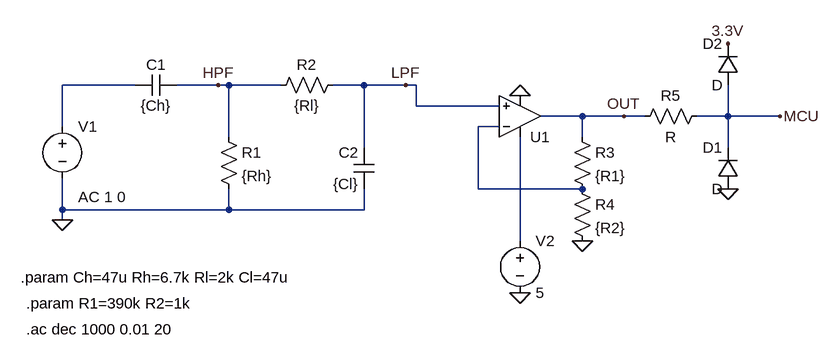
[diagram p0: schematic lab8.asc]
lab8.asc, the LTspice schematic file:
Version 4
SHEET 1 1192 680
WIRE 128 -64 16 -64
WIRE 256 -64 192 -64
WIRE 272 -64 256 -64
WIRE 352 -64 272 -64
WIRE 480 -64 432 -64
WIRE 544 -64 480 -64
WIRE 560 -64 544 -64
WIRE 560 -32 560 -64
WIRE 688 -32 560 -32
WIRE 816 -16 752 -16
WIRE 880 -16 816 -16
WIRE 912 -16 880 -16
WIRE 1040 -16 1040 -64
WIRE 1040 -16 992 -16
WIRE 1120 -16 1040 -16
WIRE 16 0 16 -64
WIRE 688 0 656 0
WIRE 272 16 272 -64
WIRE 816 16 816 -16
WIRE 480 32 480 -64
WIRE 1040 32 1040 -16
WIRE 656 96 656 0
WIRE 816 96 656 96
WIRE 16 128 16 80
WIRE 272 128 272 96
WIRE 272 128 16 128
WIRE 480 128 480 96
WIRE 480 128 272 128
WIRE 16 144 16 128
WIRE 720 176 720 16
FLAG 16 144 0
FLAG 816 176 0
FLAG 720 256 0
FLAG 720 -48 0
FLAG 256 -64 HPF
FLAG 544 -64 LPF
FLAG 880 -16 OUT
FLAG 1040 96 0
FLAG 1040 -128 3.3V
FLAG 1120 -16 MCU
SYMBOL cap 192 -80 R90
WINDOW 0 0 32 VBottom 2
WINDOW 3 32 32 VTop 2
SYMATTR InstName C1
SYMATTR Value {Ch}
SYMBOL cap 496 96 R180
WINDOW 0 24 56 Left 2
WINDOW 3 24 8 Left 2
SYMATTR InstName C2
SYMATTR Value {Cl}
SYMBOL res 256 0 R0
SYMATTR InstName R1
SYMATTR Value {Rh}
SYMBOL res 448 -80 R90
WINDOW 0 0 56 VBottom 2
WINDOW 3 32 56 VTop 2
SYMATTR InstName R2
SYMATTR Value {Rl}
SYMBOL voltage 16 -16 R0
WINDOW 123 24 124 Left 2
WINDOW 39 0 0 Left 0
SYMATTR Value2 AC 1 0
SYMATTR InstName V1
SYMATTR Value ""
SYMBOL OpAmps\\UniversalOpamp 720 -16 M180
SYMATTR InstName U1
SYMBOL res 800 0 R0
SYMATTR InstName R3
SYMATTR Value {R1}
SYMBOL res 800 80 R0
SYMATTR InstName R4
SYMATTR Value {R2}
SYMBOL voltage 720 160 R0
SYMATTR InstName V2
SYMATTR Value 5
SYMBOL diode 1056 96 R180
WINDOW 0 24 64 Left 2
WINDOW 3 24 0 Left 2
SYMATTR InstName D1
SYMBOL diode 1056 -64 R180
WINDOW 0 24 64 Left 2
WINDOW 3 24 0 Left 2
SYMATTR InstName D2
SYMBOL res 1008 -32 R90
WINDOW 0 0 56 VBottom 2
WINDOW 3 32 56 VTop 2
SYMATTR InstName R5
TEXT -48 232 Left 2 !.param Ch=47u Rh=6.7k Rl=2k Cl=47u
TEXT -40 272 Left 2 !.param R1=390k R2=1k
TEXT -40 312 Left 2 !.ac dec 1000 0.01 20

The netlist it stands for:
* lab8.asc
C1 HPF N001 {Ch}
C2 0 LPF {Cl}
R1 HPF 0 {Rh}
R2 LPF HPF {Rl}
V1 N001 0 AC 1 0
XU1 LPF N002 N003 0 OUT level1 Avol=1Meg GBW=10Meg Vos=0 En=0 Enk=0 In=0 Ink=0 Rin=500Meg  ; pins In+ In- V+ V- OUT
R3 OUT N002 {R1}
R4 N002 0 {R2}
V2 N003 0 5
D1 0 MCU D
D2 MCU 3.3V D
R5 MCU OUT R
.model D D
.lib standard.dio
.param Ch=47u Rh=6.7k Rl=2k Cl=47u
.param R1=390k R2=1k
.ac dec 1000 0.01 20
.lib UniversalOpAmp1.lib
.backanno
.end